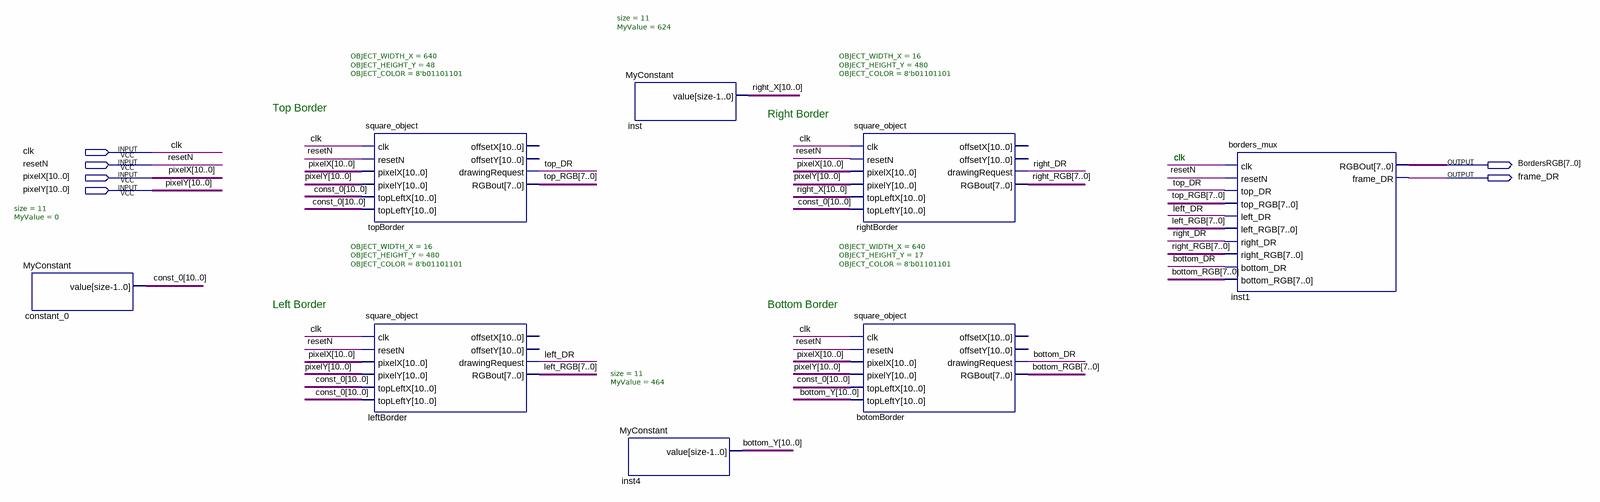
[diagram p0: schematic sheet]
// Quartus schematic Frame_Blocks.bdf as structural Verilog: 8 symbols, 6 pins
module Frame_Blocks (
  input  clk,
  input  resetN,
  input  [10:0] pixelX,
  input  [10:0] pixelY,
  output [7:0] BordersRGB,
  output frame_DR
);

  wire bottom_DR, left_DR, right_DR, top_DR;
  wire [7:0] bottom_RGB, left_RGB, right_RGB, top_RGB;
  wire [10:0] bottom_Y, const_0, right_X;

  MyConstant #(.size(11), .MyValue(0)) constant_0 (.value(const_0));
  square_object #(.OBJECT_WIDTH_X(640), .OBJECT_HEIGHT_Y(48), .OBJECT_COLOR(8'b01101101)) topBorder (
    .clk(clk), .resetN(resetN), .pixelX(pixelX), .pixelY(pixelY), .topLeftX(const_0), .topLeftY(const_0),
    .drawingRequest(top_DR), .RGBout(top_RGB));  // open: offsetX, offsetY
  square_object #(.OBJECT_WIDTH_X(16), .OBJECT_HEIGHT_Y(480), .OBJECT_COLOR(8'b01101101)) leftBorder (
    .clk(clk), .resetN(resetN), .pixelX(pixelX), .pixelY(pixelY), .topLeftX(const_0), .topLeftY(const_0),
    .drawingRequest(left_DR), .RGBout(left_RGB));  // open: offsetX, offsetY
  MyConstant #(.size(11), .MyValue(624)) inst (.value(right_X));
  MyConstant #(.size(11), .MyValue(464)) inst4 (.value(bottom_Y));
  square_object #(.OBJECT_WIDTH_X(16), .OBJECT_HEIGHT_Y(480), .OBJECT_COLOR(8'b01101101)) rightBorder (
    .clk(clk), .resetN(resetN), .pixelX(pixelX), .pixelY(pixelY), .topLeftX(right_X), .topLeftY(const_0),
    .drawingRequest(right_DR), .RGBout(right_RGB));  // open: offsetX, offsetY
  square_object #(.OBJECT_WIDTH_X(640), .OBJECT_HEIGHT_Y(17), .OBJECT_COLOR(8'b01101101)) botomBorder (
    .clk(clk), .resetN(resetN), .pixelX(pixelX), .pixelY(pixelY), .topLeftX(const_0), .topLeftY(bottom_Y),
    .drawingRequest(bottom_DR), .RGBout(bottom_RGB));  // open: offsetX, offsetY
  borders_mux inst1 (
    .clk(clk), .resetN(resetN), .top_DR(top_DR), .top_RGB(top_RGB), .left_DR(left_DR), .left_RGB(left_RGB),
    .right_DR(right_DR), .right_RGB(right_RGB), .bottom_DR(bottom_DR), .bottom_RGB(bottom_RGB),
    .RGBOut(BordersRGB), .frame_DR(frame_DR));

  // Notes on the sheet:
  //   Top Border
  //   Right Border
  //   clk
  //   Left Border
  //   Bottom Border
endmodule
